# Altium schematic sheet Schematic.schdoc
size 291 x 197 mm
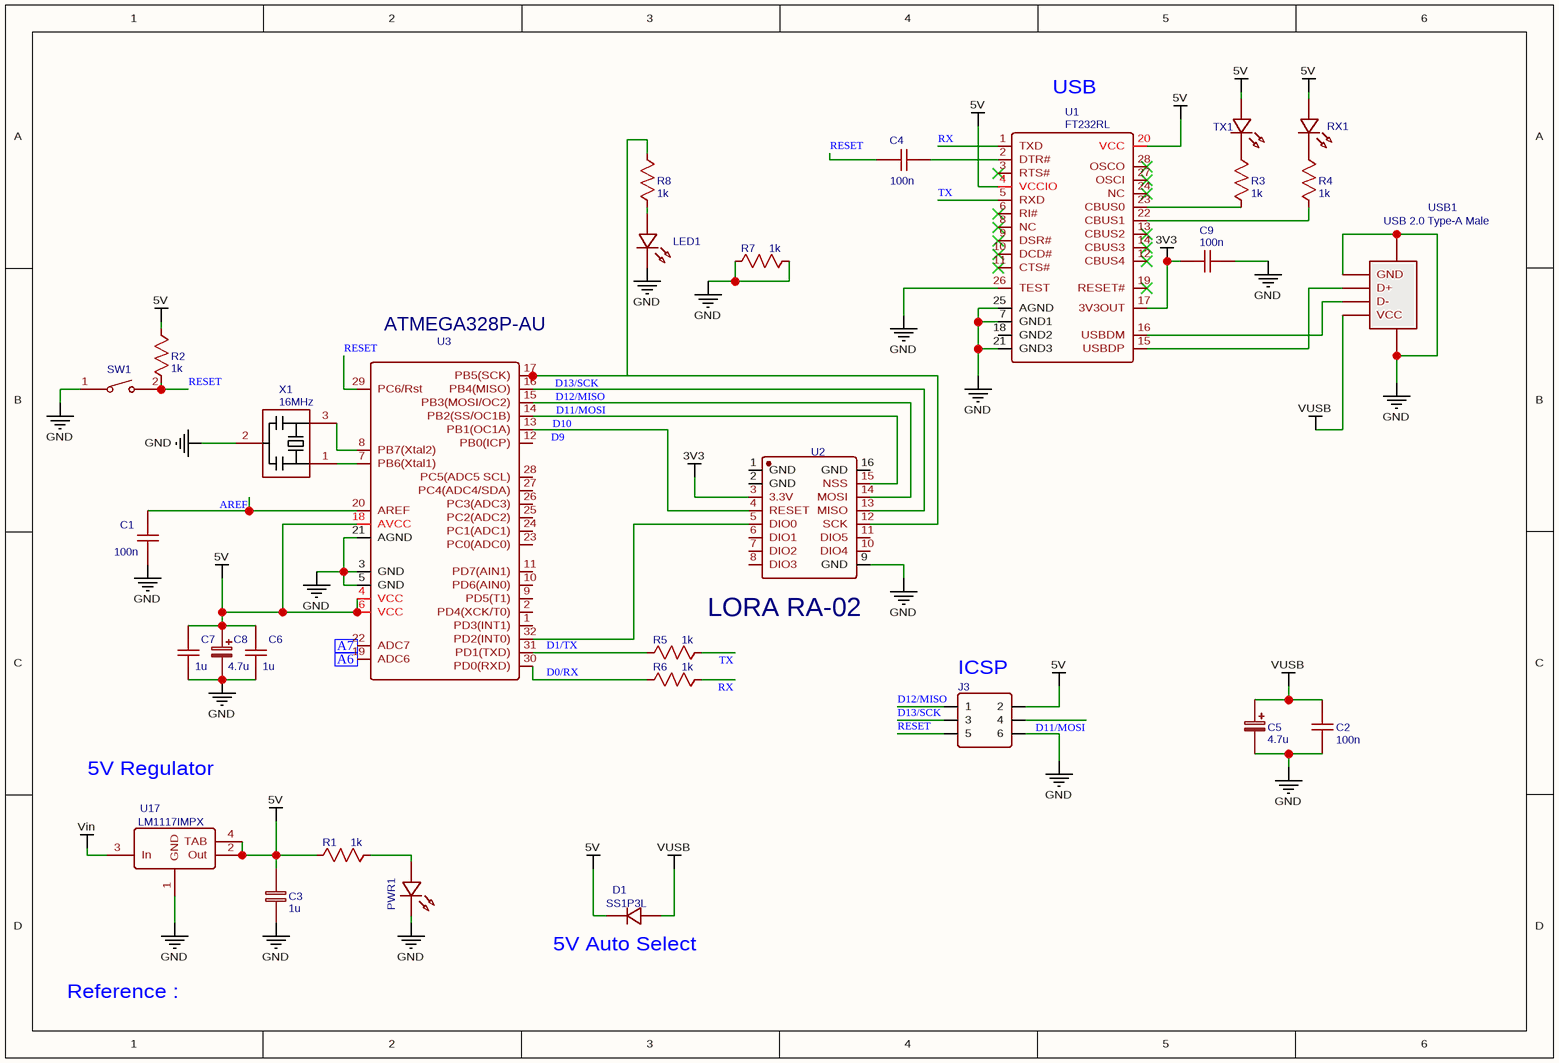
[diagram p0: Schematic.schdoc]

## Parts
C1  100n  [C0603]
C2  100n  [C0603]
C3  1u  [C0603]
C4  100n  [C0603]
C5  4.7u  [CASE-A_3216]
C6  1u  [C0603]
C7  1u  [C0603]
C8  4.7u  [CASE-A_3216]
C9  100n  [C0603]
D1  SS1P3L  [SOD-123FL_L2.6-W1.6-LS3.4-RD]
J3  HDR-M-2.54_2x3  [HDR-M-2.54_2X3]  (value not drawn)
LED1  LED-0603_B  [LED0603_BLUE]  (value not drawn)
PWR1  LED-0603_G  [LED0603_GREEN]  (value not drawn)
R1  1k  [R0603]
R2  1k  [R0603]
R3  1k  [R0603]
R4  1k  [R0603]
R5  1k  [R0603]
R6  1k  [R0603]
R7  1k  [R0603]
R8  1k  [R0603]
RX1  LED-0603_R  [LED0603_RED]  (value not drawn)
SW1  TS-1088-AR02016  [SW-SMD_L4.0-W2.9-LS5.0]  (value not drawn)
TX1  LED-0603_G  [LED0603_GREEN]  (value not drawn)
U1  FT232RL  [SSOP-28_L10.2-W5.3-P0.65-LS7.8-BL]
U2  LORA RA-02  [COMM-SMD_16P-L17.0-W16.0-P2.00]
U3  ATMEGA328P-AU  [TQFP-32_L7.0-W7.0-P0.50-BL]
U17  LM1117IMPX  [SOT-223]
USB1  USB 2.0 Type-A Male  [USB 2.0 TYPE-A MALE]
X1  16MHz  [OSC-SMD_3P-L3.2-W1.3-P1.2-L]

## Ports
A6 (in), A7 (in)

## Nets
3V3: C9.1 U1.17(3V3OUT) U2.3(3.3V)
5V: C3.2 C6.2 C7.2 C8.1 D1.1 J3.2 R1.2 R2.2 RX1.1 TX1.1 U1.4(VCCIO) U1.20(VCC) U3.4(VCC) U3.6(VCC) U3.18(AVCC) U17.2(Out) U17.4(TAB)
GND: C1.2 C2.2 C3.1 C5.2 C6.1 C7.1 C8.2 C9.2 J3.6 LED1.2 PWR1.2 R7.1 R7.2 SW1.1 U1.7(GND1) U1.21(GND3) U1.25(AGND) U1.26(TEST) U2.9(GND) U3.3(GND) U3.5(GND) U3.21(AGND) U17.1(GND) USB1.0 USB1.4(GND) USB1.6 X1.2
Vin: U17.3(In)
VUSB: C2.1 C5.1 D1.2 USB1.1(VCC)
A6: U3.19(ADC6) ; port A6
A7: U3.22(ADC7) ; port A7
AREF: C1.1 U3.20(AREF)
D0/RX: R6.2 U3.30(PD0(RXD))
D1/TX: R5.2 U3.31(PD1(TXD))
D9: U2.4(RESET) U3.13(PB1(OC1A))
D10: U2.15(NSS) U3.14(PB2(SS/OC1B))
D11/MOSI: J3.4 U2.14(MOSI) U3.15(PB3(MOSI/OC2))
D12/MISO: J3.1 U2.13(MISO) U3.16(PB4(MISO))
D13/SCK: J3.3 R8.1 U2.12(SCK) U3.17(PB5(SCK))
RESET: C4.2 J3.5 R2.1 SW1.2 U3.29(PC6/Rst)
RX: R6.1 U1.1(TXD)
TX: R5.1 U1.5(RXD)
NetC4_1: C4.1 U1.2(DTR#)
NetLED1_1: LED1.1 R8.2
NetPWR1_1: PWR1.1 R1.1
NetR3_1: R3.1 TX1.2
NetR3_2: R3.2 U1.23(CBUS0)
NetR4_1: R4.1 RX1.2
NetR4_2: R4.2 U1.22(CBUS1)
NetU1_15: U1.15(USBDP) USB1.3(D+)
NetU1_16: U1.16(USBDM) USB1.2(D-)
NetU2_5: U2.5(DIO0) U3.32(PD2(INT0))
NetU3_7: U3.7(PB6(Xtal1)) X1.1
NetU3_8: U3.8(PB7(Xtal2)) X1.3

Not connected (* = marked no-connect by the designer): U1 3(RTS#)* 6(RI#)* 8(NC)* 9(DSR#)* 10(DCD#)* 11(CTS#)* 12(CBUS4)* 13(CBUS2)* 14(CBUS3)* 18(GND2) 19(RESET#)* 24(NC)* 27(OSCI)* 28(OSCO)*; U2 1(GND) 2(GND) 6(DIO1) 7(DIO2) 8(DIO3) 10(DIO4) 11(DIO5) 16(GND); U3 1(PD3(INT1)) 2(PD4(XCK/T0)) 9(PD5(T1)) 10(PD6(AIN0)) 11(PD7(AIN1)) 12(PB0(ICP)) 23(PC0(ADC0)) 24(PC1(ADC1)) 25(PC2(ADC2)) 26(PC3(ADC3)) 27(PC4(ADC4/SDA)) 28(PC5(ADC5_SCL))

## Notes on the sheet
- (near U1) USB
- (near J3) ICSP
- 5V Regulator
- (near D1) 5V Auto Select
- Reference :

## Library data of the parts
C1 C2 C4 C9 = 100n: nameAlias: Value(F); Contributor: LCEDA_Lib; spicePre: C; spiceSymbolName: C_0603_US
C3 C6 C7 = 1u: nameAlias: Value(F); Contributor: LCEDA_Lib; spicePre: C
  C3: spiceSymbolName: C_0603_EU
  C6 C7: spiceSymbolName: C_0603_US
C5 C8 = 4.7u: nameAlias: Value(F); Contributor: LCEDA_Lib; spicePre: C; spiceSymbolName: C_Tan_SMD_A_EU
D1 = SS1P3L: Manufacturer: Tak Cheong; Manufacturer Part: 1N4148W; Contributor: LCEDA_Lib; Supplier: LCSC; Supplier Part: C129216; spicePre: D; spiceSymbolName: 1N4148W
J3 = HDR-M-2.54_2x3: Contributor: LCEDA_Lib; Supplier Part: C65114; Supplier: LCSC; spicePre: J; spiceSymbolName: HDR-M-2.54_2x3
LED1 = LED-0603_B: Manufacturer: EVERLIGHT(台湾亿光); Manufacturer Part: 19-217/BHC-ZL1M2RY/3T; Contributor: LCEDA_01; Supplier Part: C72041; Supplier: LCSC; spicePre: L; spiceSymbolName: LED-0603_B
PWR1 TX1 = LED-0603_G: Manufacturer: EVERLIGHT(台湾亿光); Manufacturer Part: 19-217/GHC-YR1S2/3T; Contributor: LCEDA_Lib; Supplier Part: C72043; Supplier: LCSC; spicePre: L; spiceSymbolName: LED-0603_G
R1-R8 = 1k: nameAlias: Value(Ω); Contributor: LCEDA_Lib; spicePre: R; spiceSymbolName: R_0603_US
RX1 = LED-0603_R: Manufacturer: EVERLIGHT(台湾亿光); Manufacturer Part: 19-217/R6C-AL1M2VY/3T; Contributor: LCEDA_01; Supplier Part: C72044; Supplier: LCSC; spicePre: L; spiceSymbolName: LED-0603_R
SW1 = TS-1088-AR02016: Manufacturer: XUNPU; Contributor: LCSC; Supplier: LCSC; Supplier Part: C720477; Manufacturer Part: TS-1088-AR02016; JLCPCB Part Class: Extended Part; spicePre: S; spiceSymbolName: TS-1088-AR02016
U1 = FT232RL: Manufacturer: null; Contributor: Alex_Tien; Supplier: LCSC; Supplier Part: C490691; Manufacturer Part: FT232RL; JLCPCB Part Class: Extended Part; spicePre: U; spiceSymbolName: FT232RL
U2 = LORA RA-02: Manufacturer: null; Manufacturer Part: LORA 专属定制版(公司内部定制,独一无二) RA-02; Contributor: LCSC; Supplier: LCSC; Supplier Part: C9900000331; JLCPCB Part Class: Extended Part; spicePre: U; spiceSymbolName: LORA 专属定制版(公司内部定制,独一无二) RA-02
U3 = ATMEGA328P-AU: Manufacturer: Microchip Technology / Atmel; Contributor: Alex_Tien; Manufacturer Part: ATMEGA328P-AU; Supplier: Mouser; Supplier Part: 556-ATMEGA328P-AU; link: https://www.mouser.tw/ProductDetail/Microchip-Technology-Atmel/ATMEGA328P-AU?qs=sGAEpiMZZMtVoztFdqDXO3RbBx7FKCmV; spicePre: U; spiceSymbolName: ATMEGA328P-AU
U17 = LM1117IMPX: Manufacturer: AMS; Manufacturer Part: AMS1117-3.3; sourceId: dwIGgezVh; timeStamp: 1476261164; Supplier Part: C6186; Supplier: LCSC; LCSC Assembly: Yes; image: //image.lceda.cn/szlcsc/C6186.jpg; spicePre: U
USB1 = USB 2.0 Type-A Male: Manufacturer: ValuePro; Manufacturer Part: USB Male Plugin; Contributor: pyramidak; Supplier Part: C9739; Supplier: LCSC; link: https://sharvielectronics.com/product/usb-a-type-plug-male-pcb-mountable-right-angle-connector/; spicePre: U; spiceSymbolName: USB 2.0 Type-A Male
X1 = 16MHz: Manufacturer: MuRata; Manufacturer Part: CSTCE16M0V53-R0; nameAlias: Frequency; Contributor: Alex_Tien; Supplier: Digi-Key; Supplier Part: 490-1198-1-ND; link: https://www.digikey.de/product-detail/en/CSTCE16M0V53-R0/490-1198-1-ND/584635; spicePre: X; spiceSymbolName: CSTCE16M0V53C-R0